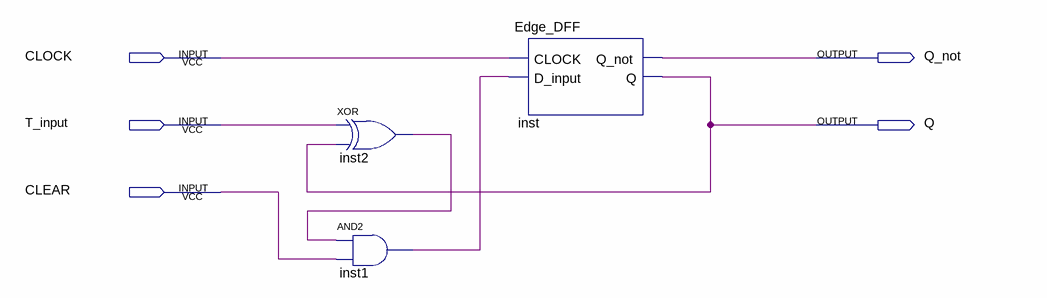
[diagram p0: schematic sheet]
// Quartus schematic Edge_TFF.bdf as structural Verilog: 3 symbols, 5 pins
module Edge_TFF (
  input  CLOCK,
  input  T_input,
  input  CLEAR,
  output Q_not,
  output Q
);

  wire inst1_out, inst2_out;

  xor inst2 (inst2_out, T_input, Q);
  and inst1 (inst1_out, inst2_out, CLEAR);
  Edge_DFF inst (.CLOCK(CLOCK), .D_input(inst1_out), .Q_not(Q_not), .Q(Q));
endmodule
